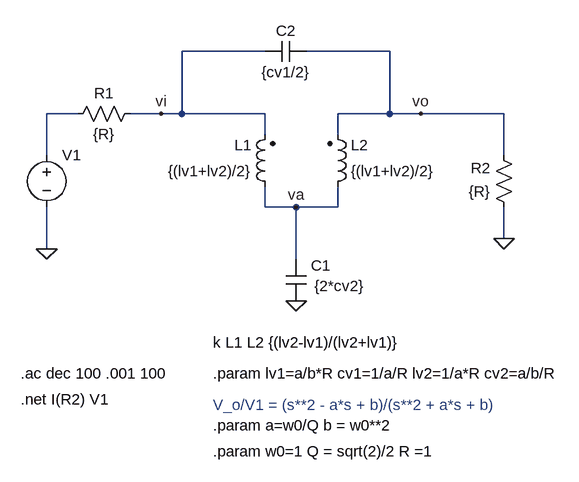
[diagram p0: schematic tee_puen_2ord_delay_eq2.asc]
tee_puen_2ord_delay_eq2.asc, the LTspice schematic file:
Version 4
SHEET 1 1364 1328
WIRE 336 368 208 368
WIRE 528 368 400 368
WIRE 48 464 0 464
WIRE 176 464 128 464
WIRE 208 464 208 368
WIRE 208 464 176 464
WIRE 336 464 208 464
WIRE 528 464 528 368
WIRE 528 464 448 464
WIRE 576 464 528 464
WIRE 704 464 576 464
WIRE 336 496 336 464
WIRE 448 496 448 464
WIRE 0 528 0 464
WIRE 704 528 704 464
WIRE 336 608 336 576
WIRE 384 608 336 608
WIRE 448 608 448 576
WIRE 448 608 384 608
WIRE 704 656 704 608
WIRE 0 672 0 608
WIRE 384 688 384 608
FLAG 0 672 0
FLAG 176 464 vi
FLAG 576 464 vo
FLAG 384 752 0
FLAG 704 656 0
FLAG 384 608 va
SYMBOL voltage 0 512 R0
WINDOW 3 24 96 Invisible 2
SYMATTR Value 0
SYMATTR InstName V1
SYMATTR Value2 AC 1 0
SYMATTR SpiceLine Rser=0
SYMBOL res 144 448 R90
WINDOW 0 0 56 VBottom 2
WINDOW 3 32 56 VTop 2
SYMATTR InstName R1
SYMATTR Value {R}
SYMBOL res 720 624 R180
WINDOW 0 36 76 Left 2
WINDOW 3 36 40 Left 2
SYMATTR InstName R2
SYMATTR Value {R}
SYMBOL cap 368 688 R0
WINDOW 0 39 10 Left 2
WINDOW 3 44 41 Left 2
SYMATTR InstName C1
SYMATTR Value {2*cv2}
SYMATTR SpiceLine Rser=0
SYMBOL cap 400 352 R90
WINDOW 0 0 32 VBottom 2
WINDOW 3 32 32 VTop 2
SYMATTR InstName C2
SYMATTR Value {cv1/2}
SYMATTR SpiceLine Rser=0
SYMBOL ind2 352 592 R180
WINDOW 0 36 80 Left 2
WINDOW 3 36 40 Left 2
SYMATTR InstName L1
SYMATTR Value {(lv1+lv2)/2}
SYMATTR Type ind
SYMATTR SpiceLine Rser=0
SYMBOL ind2 432 592 M180
WINDOW 0 36 80 Left 2
WINDOW 3 36 40 Left 2
SYMATTR InstName L2
SYMATTR Value {(lv1+lv2)/2}
SYMATTR Type ind
SYMATTR SpiceLine Rser=0
TEXT -40 904 Left 2 !.net I(R2) V1
TEXT -40 864 Left 2 !.ac dec 100 .001 100
TEXT 256 864 Left 2 !.param lv1=a/b*R cv1=1/a/R lv2=1/a*R cv2=a/b/R
TEXT 256 944 Left 2 !.param a=w0/Q b = w0**2
TEXT 256 816 Left 2 !k L1 L2 {(lv2-lv1)/(lv2+lv1)}
TEXT 256 912 Left 2 ;V_o/V1 = (s**2 - a*s + b)/(s**2 + a*s + b)
TEXT 256 984 Left 2 !.param w0=1 Q = sqrt(2)/2 R =1

The netlist it stands for:
* tee_puen_2ord_delay_eq2.asc
V1 N001 0 0 AC 1 0 Rser=0
R1 vi N001 {R}
R2 0 vo {R}
C1 va 0 {2*cv2} Rser=0
C2 vo vi {cv1/2} Rser=0
L1 va vi {(lv1+lv2)/2} Rser=0
L2 va vo {(lv1+lv2)/2} Rser=0
.net I(R2) V1
.ac dec 100 .001 100
.param lv1=a/b*R cv1=1/a/R lv2=1/a*R cv2=a/b/R
.param a=w0/Q b = w0**2
k L1 L2 {(lv2-lv1)/(lv2+lv1)}
* V_o/V1 = (s**2 - a*s + b)/(s**2 + a*s + b)
.param w0=1 Q = sqrt(2)/2 R =1
.backanno
.end